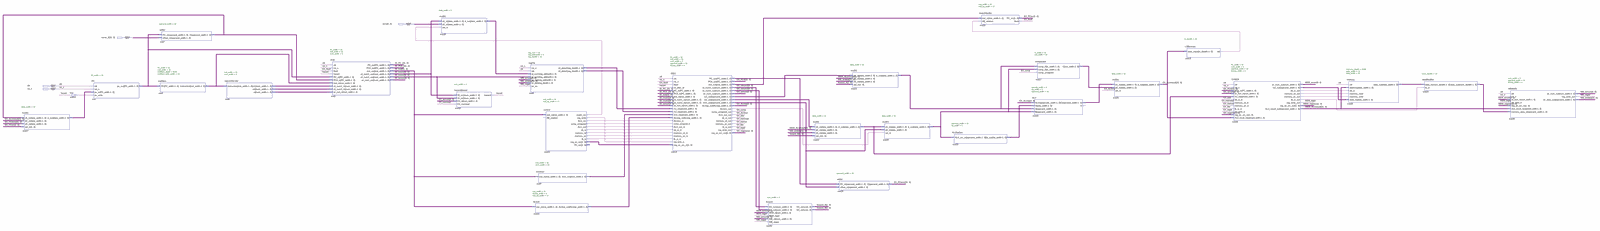
[diagram p0: schematic sheet, whole]
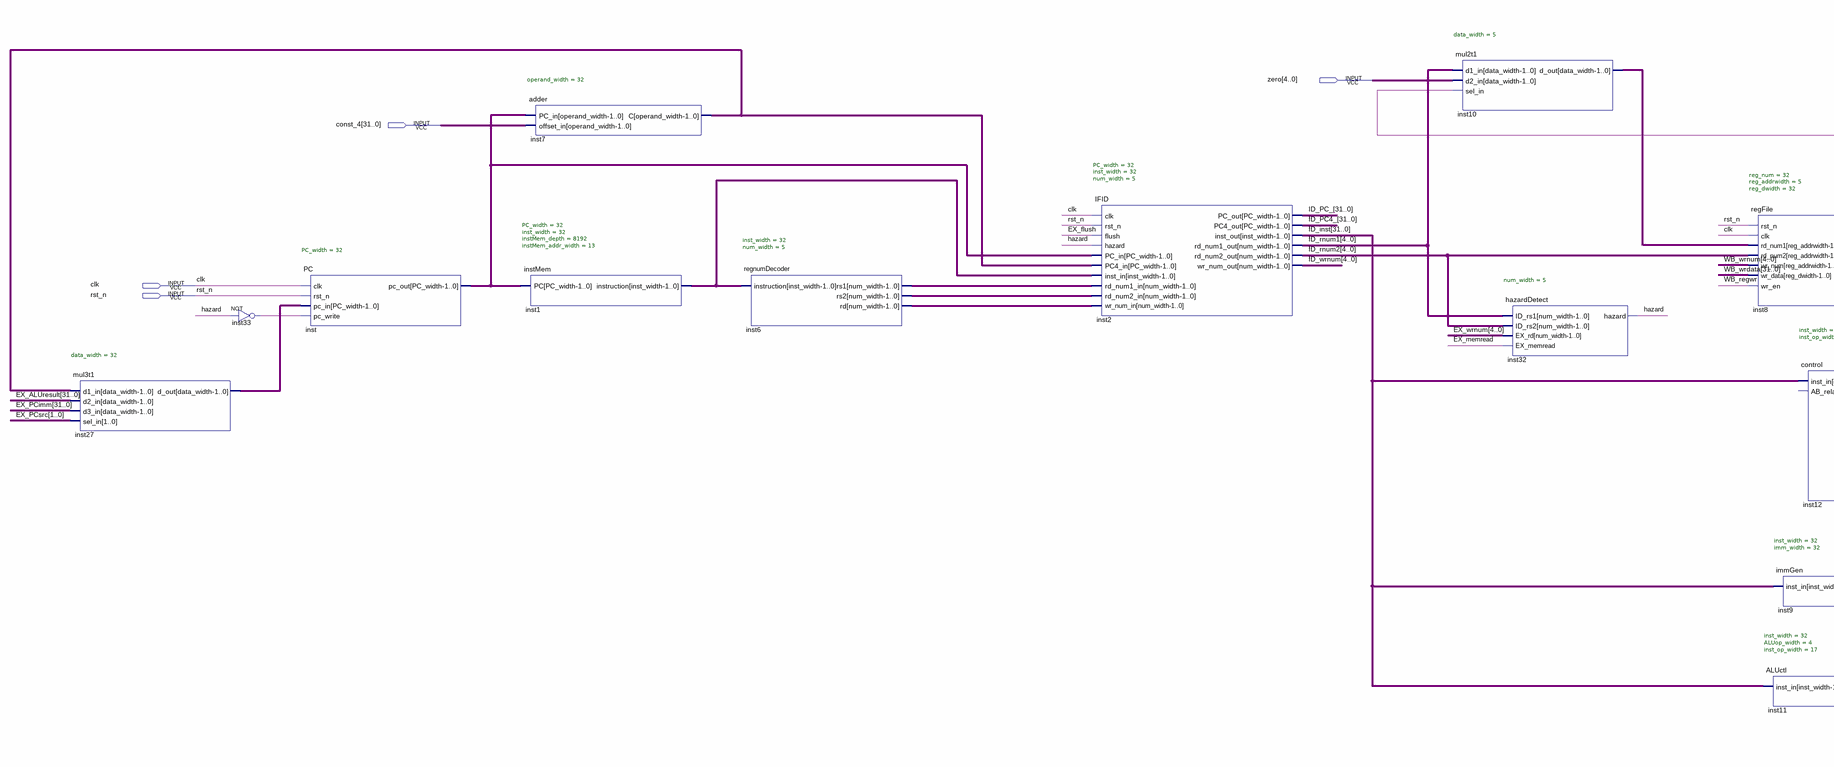
[diagram p1: schematic sheet, left part]
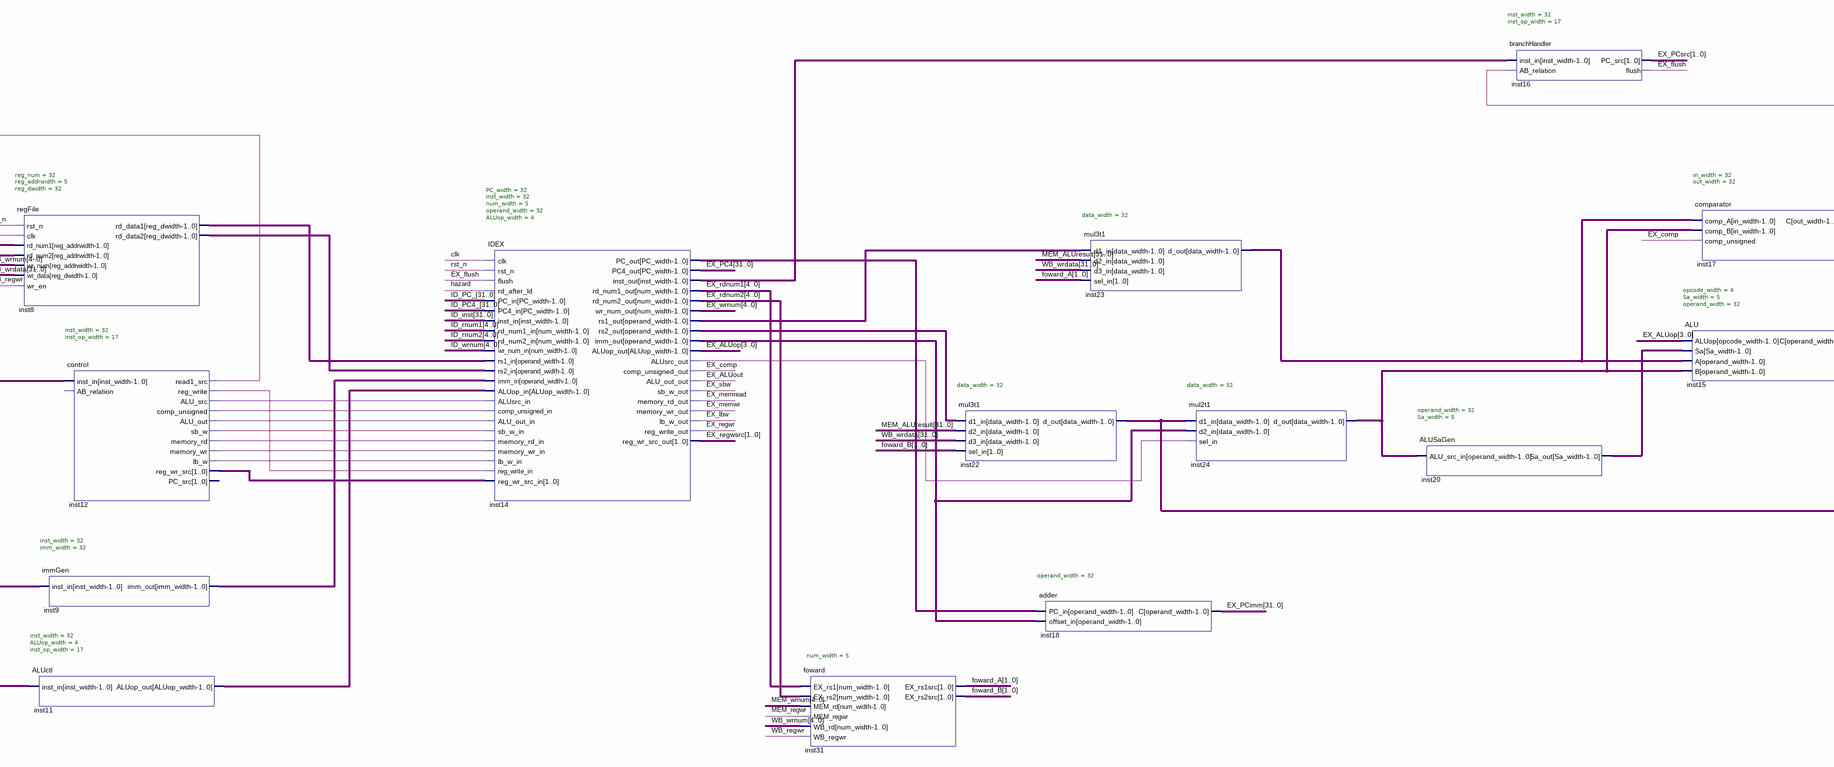
[diagram p2: schematic sheet, centre part]
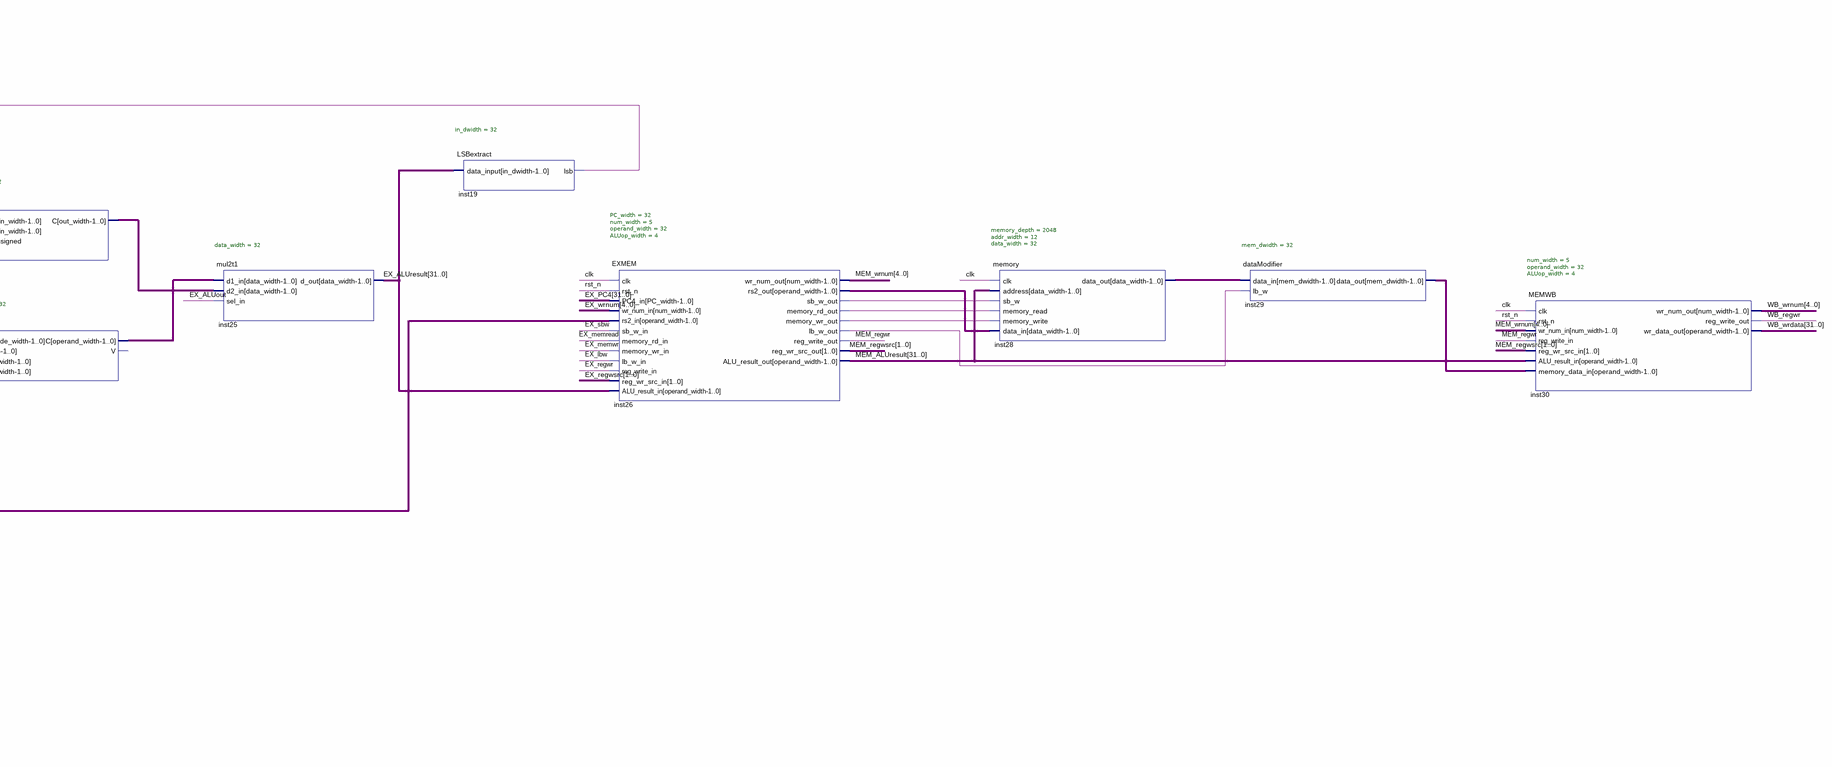
[diagram p3: schematic sheet, right part]
// Quartus schematic pipeline.bdf as structural Verilog: 29 symbols, 4 pins
module pipeline (
  input  [4:0] zero,
  input  [31:0] const_4,
  input  clk,
  input  rst_n
);

  wire EX_ALUout, EX_comp, EX_flush, EX_lbw, EX_memread, EX_memwr, EX_regwr, EX_sbw, hazard, inst12_alu_out,
       inst12_alu_src, inst12_comp_unsigned, inst12_lb_w, inst12_memory_rd, inst12_memory_wr,
       inst12_read1_src, inst12_reg_write, inst12_sb_w, inst14_alusrc_out, inst19_lsb, inst26_lb_w_out,
       inst26_memory_rd_out, inst26_memory_wr_out, inst26_sb_w_out, inst33_out, MEM_regwr, WB_regwr;
  wire [1:0] EX_PCsrc, EX_regwsrc, foward_A, foward_B, inst12_reg_wr_src, MEM_regwsrc;
  wire [3:0] EX_ALUop, inst11_aluop_out;
  wire [4:0] EX_rdnum1, EX_rdnum2, EX_wrnum, ID_rnum1, ID_rnum2, ID_wrnum, inst6_rd, inst6_rs1, inst6_rs2,
       inst10_d_out, inst20_sa_out, MEM_wrnum, WB_wrnum;
  wire [31:0] EX_ALUresult, EX_PC4, EX_PCimm, ID_inst, ID_PC4_, ID_PC_, inst1_instruction, inst7_c,
       inst8_rd_data1, inst8_rd_data2, inst9_imm_out, inst14_imm_out, inst14_inst_out, inst14_pc_out,
       inst14_rs1_out, inst14_rs2_out, inst15_c, inst17_c, inst22_d_out, inst23_d_out, inst24_d_out,
       inst26_rs2_out, inst27_d_out, inst28_data_out, inst29_data_out, inst_pc_out, MEM_ALUresult, WB_wrdata;

  mul3t1 #(.data_width(32)) inst27 (
    .d1_in(inst7_c), .d2_in(EX_ALUresult), .d3_in(EX_PCimm), .sel_in(EX_PCsrc), .d_out(inst27_d_out));
  not inst33 (inst33_out, hazard);
  PC #(.PC_width(32)) inst (
    .clk(clk), .rst_n(rst_n), .pc_in(inst27_d_out), .pc_write(inst33_out), .pc_out(inst_pc_out));
  adder #(.operand_width(32)) inst7 (.PC_in(inst_pc_out), .offset_in(const_4), .C(inst7_c));
  instMem #(.PC_width(32), .inst_width(32), .instMem_depth(8192), .instMem_addr_width(13)) inst1 (
    .PC(inst_pc_out), .instruction(inst1_instruction));
  regnumDecoder #(.inst_width(32), .num_width(5)) inst6 (
    .instruction(inst1_instruction), .rs1(inst6_rs1), .rs2(inst6_rs2), .rd(inst6_rd));
  IFID #(.PC_width(32), .inst_width(32), .num_width(5)) inst2 (
    .clk(clk), .rst_n(rst_n), .flush(EX_flush), .hazard(hazard), .PC_in(inst_pc_out), .PC4_in(inst7_c),
    .inst_in(inst1_instruction), .rd_num1_in(inst6_rs1), .rd_num2_in(inst6_rs2), .wr_num_in(inst6_rd),
    .PC_out(ID_PC_), .PC4_out(ID_PC4_), .inst_out(ID_inst), .rd_num1_out(ID_rnum1), .rd_num2_out(ID_rnum2),
    .wr_num_out(ID_wrnum));
  mul2t1 #(.data_width(5)) inst10 (.d1_in(ID_rnum1), .d2_in(zero), .sel_in(inst12_read1_src), .d_out(inst10_d_out));
  hazardDetect #(.num_width(5)) inst32 (
    .ID_rs1(ID_rnum1), .ID_rs2(ID_rnum2), .EX_rd(EX_wrnum), .EX_memread(EX_memread), .hazard(hazard));
  regFile #(.reg_num(32), .reg_addrwidth(5), .reg_dwidth(32)) inst8 (
    .rst_n(rst_n), .clk(clk), .rd_num1(inst10_d_out), .rd_num2(ID_rnum2), .wr_num(WB_wrnum),
    .wr_data(WB_wrdata), .wr_en(WB_regwr), .rd_data1(inst8_rd_data1), .rd_data2(inst8_rd_data2));
  immGen #(.inst_width(32), .imm_width(32)) inst9 (.inst_in(ID_inst), .imm_out(inst9_imm_out));
  ALUctl #(.inst_width(32), .ALUop_width(4), .inst_op_width(17)) inst11 (
    .inst_in(ID_inst), .ALUop_out(inst11_aluop_out));
  control #(.inst_width(32), .inst_op_width(17)) inst12 (
    .inst_in(ID_inst), .read1_src(inst12_read1_src), .reg_write(inst12_reg_write), .ALU_src(inst12_alu_src),
    .comp_unsigned(inst12_comp_unsigned), .ALU_out(inst12_alu_out), .sb_w(inst12_sb_w),
    .memory_rd(inst12_memory_rd), .memory_wr(inst12_memory_wr), .lb_w(inst12_lb_w),
    .reg_wr_src(inst12_reg_wr_src));  // open: AB_relation, PC_src
  IDEX #(.PC_width(32), .inst_width(32), .num_width(5), .operand_width(32), .ALUop_width(4)) inst14 (
    .clk(clk), .rst_n(rst_n), .flush(EX_flush), .rd_after_ld(hazard), .PC_in(ID_PC_), .PC4_in(ID_PC4_),
    .inst_in(ID_inst), .rd_num1_in(ID_rnum1), .rd_num2_in(ID_rnum2), .wr_num_in(ID_wrnum),
    .rs1_in(inst8_rd_data1), .rs2_in(inst8_rd_data2), .imm_in(inst9_imm_out), .ALUop_in(inst11_aluop_out),
    .ALUsrc_in(inst12_alu_src), .comp_unsigned_in(inst12_comp_unsigned), .ALU_out_in(inst12_alu_out),
    .sb_w_in(inst12_sb_w), .memory_rd_in(inst12_memory_rd), .memory_wr_in(inst12_memory_wr),
    .lb_w_in(inst12_lb_w), .reg_write_in(inst12_reg_write), .reg_wr_src_in(inst12_reg_wr_src),
    .PC_out(inst14_pc_out), .PC4_out(EX_PC4), .inst_out(inst14_inst_out), .rd_num1_out(EX_rdnum1),
    .rd_num2_out(EX_rdnum2), .wr_num_out(EX_wrnum), .rs1_out(inst14_rs1_out), .rs2_out(inst14_rs2_out),
    .imm_out(inst14_imm_out), .ALUop_out(EX_ALUop), .ALUsrc_out(inst14_alusrc_out),
    .comp_unsigned_out(EX_comp), .ALU_out_out(EX_ALUout), .sb_w_out(EX_sbw), .memory_rd_out(EX_memread),
    .memory_wr_out(EX_memwr), .lb_w_out(EX_lbw), .reg_write_out(EX_regwr), .reg_wr_src_out(EX_regwsrc));
  foward #(.num_width(5)) inst31 (
    .EX_rs1(EX_rdnum1), .EX_rs2(EX_rdnum2), .MEM_rd(MEM_wrnum), .MEM_regwr(MEM_regwr), .WB_rd(WB_wrnum),
    .WB_regwr(WB_regwr), .EX_rs1src(foward_A), .EX_rs2src(foward_B));
  mul3t1 #(.data_width(32)) inst22 (
    .d1_in(inst14_rs2_out), .d2_in(MEM_ALUresult), .d3_in(WB_wrdata), .sel_in(foward_B), .d_out(inst22_d_out));
  adder #(.operand_width(32)) inst18 (.PC_in(inst14_pc_out), .offset_in(inst14_imm_out), .C(EX_PCimm));
  mul3t1 #(.data_width(32)) inst23 (
    .d1_in(inst14_rs1_out), .d2_in(MEM_ALUresult), .d3_in(WB_wrdata), .sel_in(foward_A), .d_out(inst23_d_out));
  mul2t1 #(.data_width(32)) inst24 (
    .d1_in(inst22_d_out), .d2_in(inst14_imm_out), .sel_in(inst14_alusrc_out), .d_out(inst24_d_out));
  ALUSaGen #(.operand_width(32), .Sa_width(5)) inst20 (.ALU_src_in(inst24_d_out), .Sa_out(inst20_sa_out));
  branchHandler #(.inst_width(32), .inst_op_width(17)) inst16 (
    .inst_in(inst14_inst_out), .AB_relation(inst19_lsb), .PC_src(EX_PCsrc), .flush(EX_flush));
  ALU #(.opcode_width(4), .Sa_width(5), .operand_width(32)) inst15 (
    .ALUop(EX_ALUop), .Sa(inst20_sa_out), .A(inst23_d_out), .B(inst24_d_out), .C(inst15_c));  // open: V
  comparator #(.in_width(32), .out_width(32)) inst17 (
    .comp_A(inst23_d_out), .comp_B(inst24_d_out), .comp_unsigned(EX_comp), .C(inst17_c));
  mul2t1 #(.data_width(32)) inst25 (.d1_in(inst15_c), .d2_in(inst17_c), .sel_in(EX_ALUout), .d_out(EX_ALUresult));
  LSBextract #(.in_dwidth(32)) inst19 (.data_input(EX_ALUresult), .lsb(inst19_lsb));
  EXMEM #(.PC_width(32), .num_width(5), .operand_width(32), .ALUop_width(4)) inst26 (
    .clk(clk), .rst_n(rst_n), .PC4_in(EX_PC4), .wr_num_in(EX_wrnum), .rs2_in(inst22_d_out), .sb_w_in(EX_sbw),
    .memory_rd_in(EX_memread), .memory_wr_in(EX_memwr), .lb_w_in(EX_lbw), .reg_write_in(EX_regwr),
    .reg_wr_src_in(EX_regwsrc), .ALU_result_in(EX_ALUresult), .wr_num_out(MEM_wrnum),
    .rs2_out(inst26_rs2_out), .sb_w_out(inst26_sb_w_out), .memory_rd_out(inst26_memory_rd_out),
    .memory_wr_out(inst26_memory_wr_out), .lb_w_out(inst26_lb_w_out), .reg_write_out(MEM_regwr),
    .reg_wr_src_out(MEM_regwsrc), .ALU_result_out(MEM_ALUresult));
  memory #(.memory_depth(2048), .addr_width(12), .data_width(32)) inst28 (
    .clk(clk), .address(MEM_ALUresult), .sb_w(inst26_sb_w_out), .memory_read(inst26_memory_rd_out),
    .memory_write(inst26_memory_wr_out), .data_in(inst26_rs2_out), .data_out(inst28_data_out));
  dataModifier #(.mem_dwidth(32)) inst29 (
    .data_in(inst28_data_out), .lb_w(inst26_lb_w_out), .data_out(inst29_data_out));
  MEMWB #(.num_width(5), .operand_width(32), .ALUop_width(4)) inst30 (
    .clk(clk), .rst_n(rst_n), .wr_num_in(MEM_wrnum), .reg_write_in(MEM_regwr), .reg_wr_src_in(MEM_regwsrc),
    .ALU_result_in(MEM_ALUresult), .memory_data_in(inst29_data_out), .wr_num_out(WB_wrnum),
    .reg_write_out(WB_regwr), .wr_data_out(WB_wrdata));
endmodule
